# EAGLE design cnc-opto-board (EAGLE 7.6.0)
Level/Logic Translator Board Does field I/O to TTL level and logic translation for the CNC power panel project.
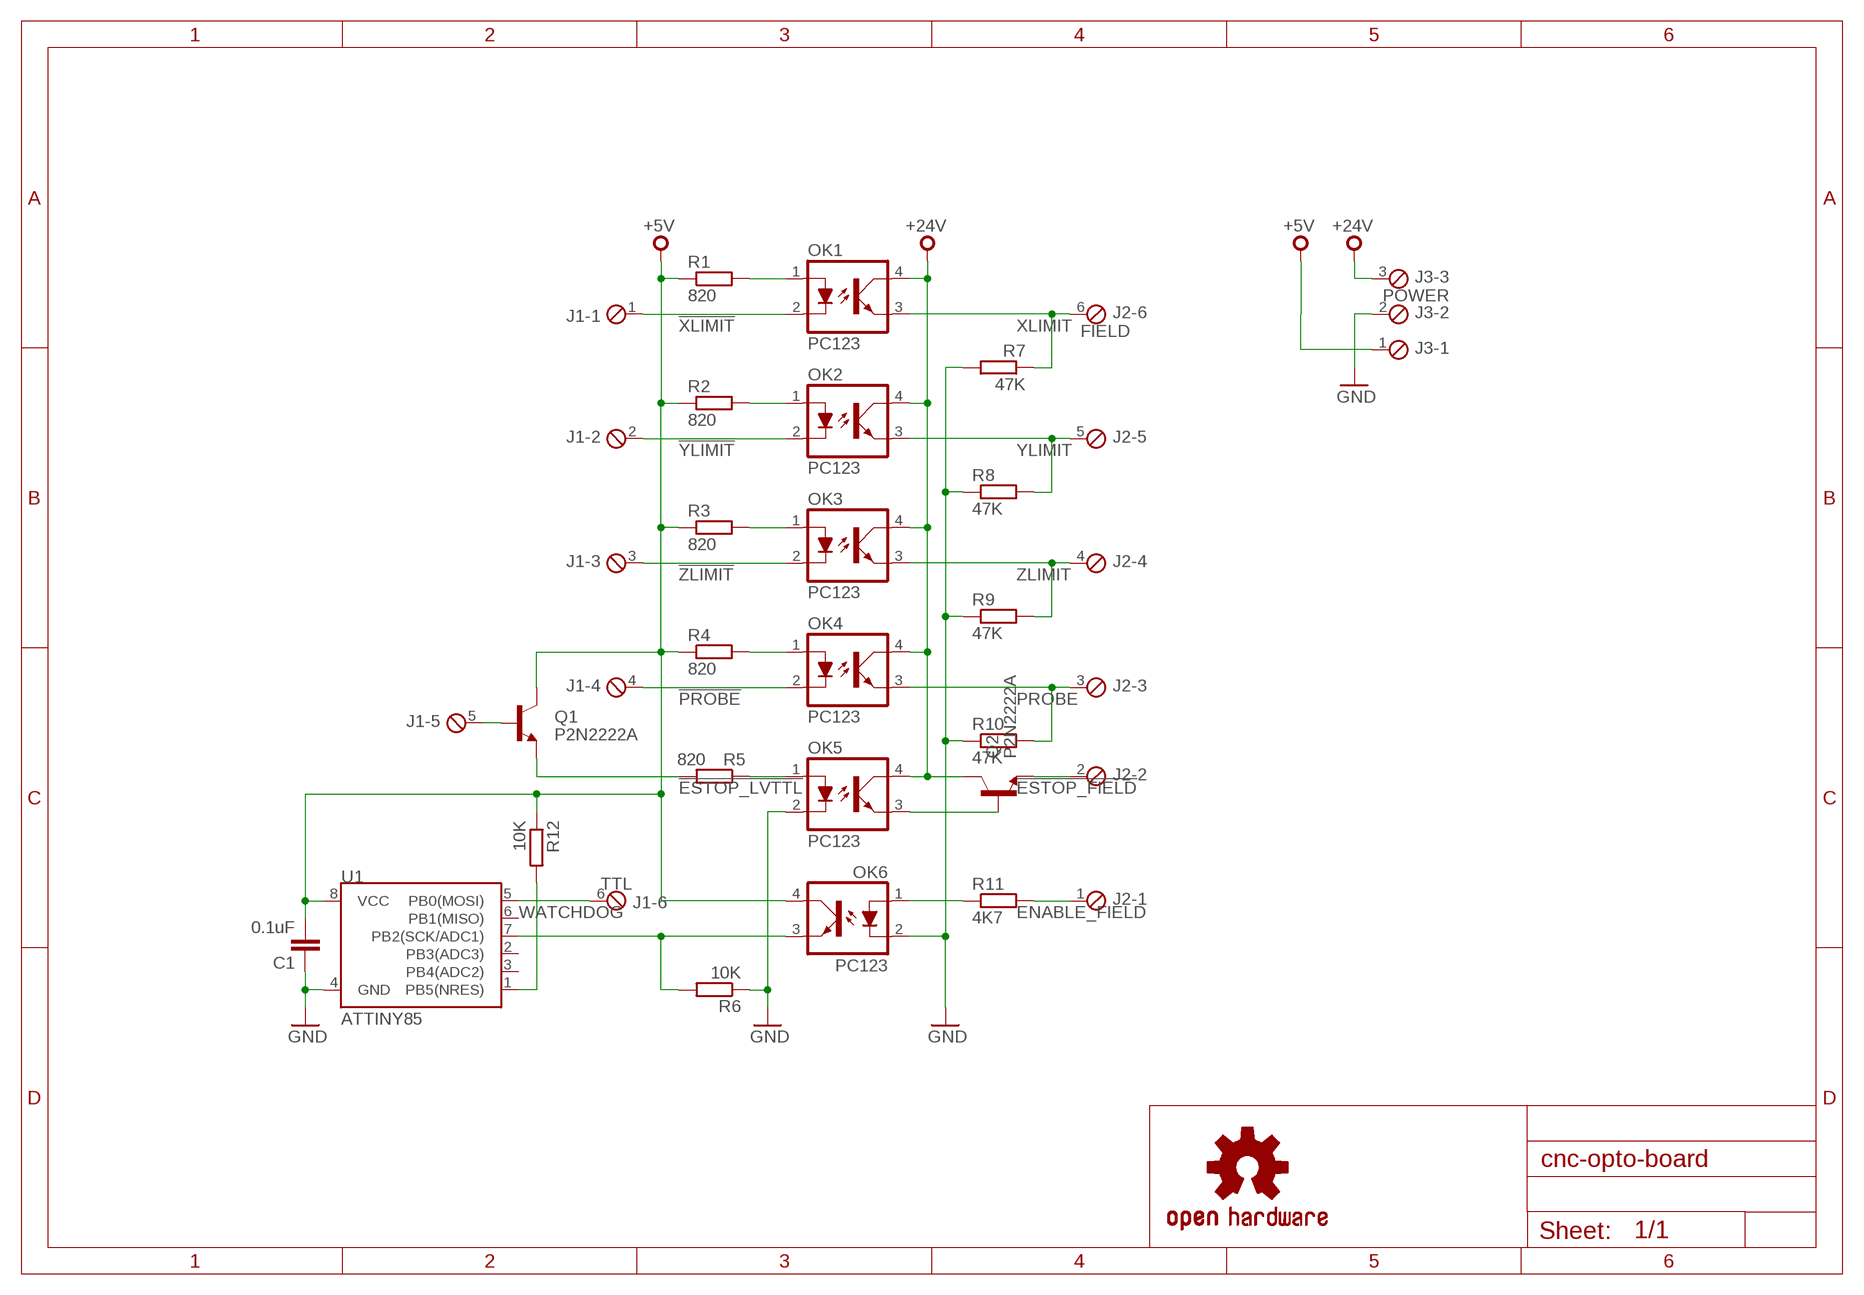
[diagram p0: schematic, sheet 1]

## Parts
C1  0.1uF  C-EU050-025X075  [C050-025X075]
J1  TTL  MKDS06  [MKDS06]
J2  FIELD  MKDS06  [MKDS06]
J3  POWER  MKDS03  [MKDS03]
LOGO1  OSHW-LOGOL  [OSHW-LOGO-L]
OK1  PC123  PC817  [DIL04]
OK2  PC123  PC817  [DIL04]
OK3  PC123  PC817  [DIL04]
OK4  PC123  PC817  [DIL04]
OK5  PC123  PC817  [DIL04]
OK6  PC123  PC817  [DIL04]
Q1  P2N2222A  TRANSISTOR_NPN_2PTH  [TO-92]
Q2  P2N2222A  TRANSISTOR_NPN_2PTH  [TO-92]
R1  820  R-EU_0207/10  [0207/10]
R2  820  R-EU_0207/10  [0207/10]
R3  820  R-EU_0207/10  [0207/10]
R4  820  R-EU_0207/10  [0207/10]
R5  820  R-EU_0207/10  [0207/10]
R6  10K  R-EU_0207/10  [0207/10]
R7  47K  R-EU_0207/10  [0207/10]
R8  47K  R-EU_0207/10  [0207/10]
R9  47K  R-EU_0207/10  [0207/10]
R10  47K  R-EU_0207/10  [0207/10]
R11  4K7  R-EU_0207/10  [0207/10]
R12  10K  R-EU_0207/10  [0207/10]
U1  ATTINY85  ATTINY45DIP8L  [DIL08]

## Nets
!ESTOP_FIELD: J2.2 Q2.3(E)
!ESTOP_LVTTL: OK5.1(A) R5.1
!PROBE: J1.4 OK4.2(C)
!XLIMIT: J1.1 OK1.2(C)
!YLIMIT: J1.2 OK2.2(C)
!ZLIMIT: J1.3 OK3.2(C)
+5V: C1.2 J3.1 OK6.4(COL) Q1.1(C) R1.1 R2.1 R3.1 R4.1 R12.1 U1.8(VCC)
+24V: J3.3 OK1.4(COL) OK2.4(COL) OK3.4(COL) OK4.4(COL) OK5.4(COL) Q2.1(C)
ENABLE_FIELD: J2.1 R11.2
ENABLE_TTL: OK6.3(EMIT) R6.2 U1.7(PB2(SCK/ADC1))
GND: C1.1 J3.2 OK5.2(C) OK6.2(C) R6.1 R7.2 R8.1 R9.1 R10.1 U1.4(GND)
N$1: OK1.1(A) R1.2
N$2: OK2.1(A) R2.2
N$3: OK3.1(A) R3.2
N$4: OK4.1(A) R4.2
N$5: Q1.3(E) R5.2
N$6: OK6.1(A) R11.1
N$7: J1.5 Q1.2(B)
N$8: OK5.3(EMIT) Q2.2(B)
N$9: R12.2 U1.1(PB5(NRES))
PROBE: J2.3 OK4.3(EMIT) R10.2
WATCHDOG: J1.6 U1.5(PB0(MOSI))
XLIMIT: J2.6 OK1.3(EMIT) R7.1
YLIMIT: J2.5 OK2.3(EMIT) R8.2
ZLIMIT: J2.4 OK3.3(EMIT) R9.2
Unconnected: U1.2(PB3(ADC3)) U1.3(PB4(ADC2)) U1.6(PB1(MISO))

## Library data of the parts
C1 = rcl:C-EU: CAPACITOR, European symbol
J1 J2 = con-phoenix-508:MKDS06: Screw Connector
J3 = con-phoenix-508:MKDS03: Screw Connector
LOGO1 = SparkFun-Aesthetics:OSHW-LOGO: Open Source Hardware Logo This logo indicates the piece of hardware it is found on incorporates a OSHW license and/or adheres to the definition of open source hardware found here: http://freedomdefined.org/OSHW
OK1-OK6 = optocoupler:PC817: SHARP OPTO COUPLER
Q1 Q2 = SparkFun-DiscreteSemi:TRANSISTOR_NPN_2: Alternate TO-92 NPN BJT
R1-R12 = rcl:R-EU_: RESISTOR, European symbol
U1 = SparkFun-DigitalIC-mine:ATTINY45: Atmel 8-pin 2/4/8kB flash uC

## Board
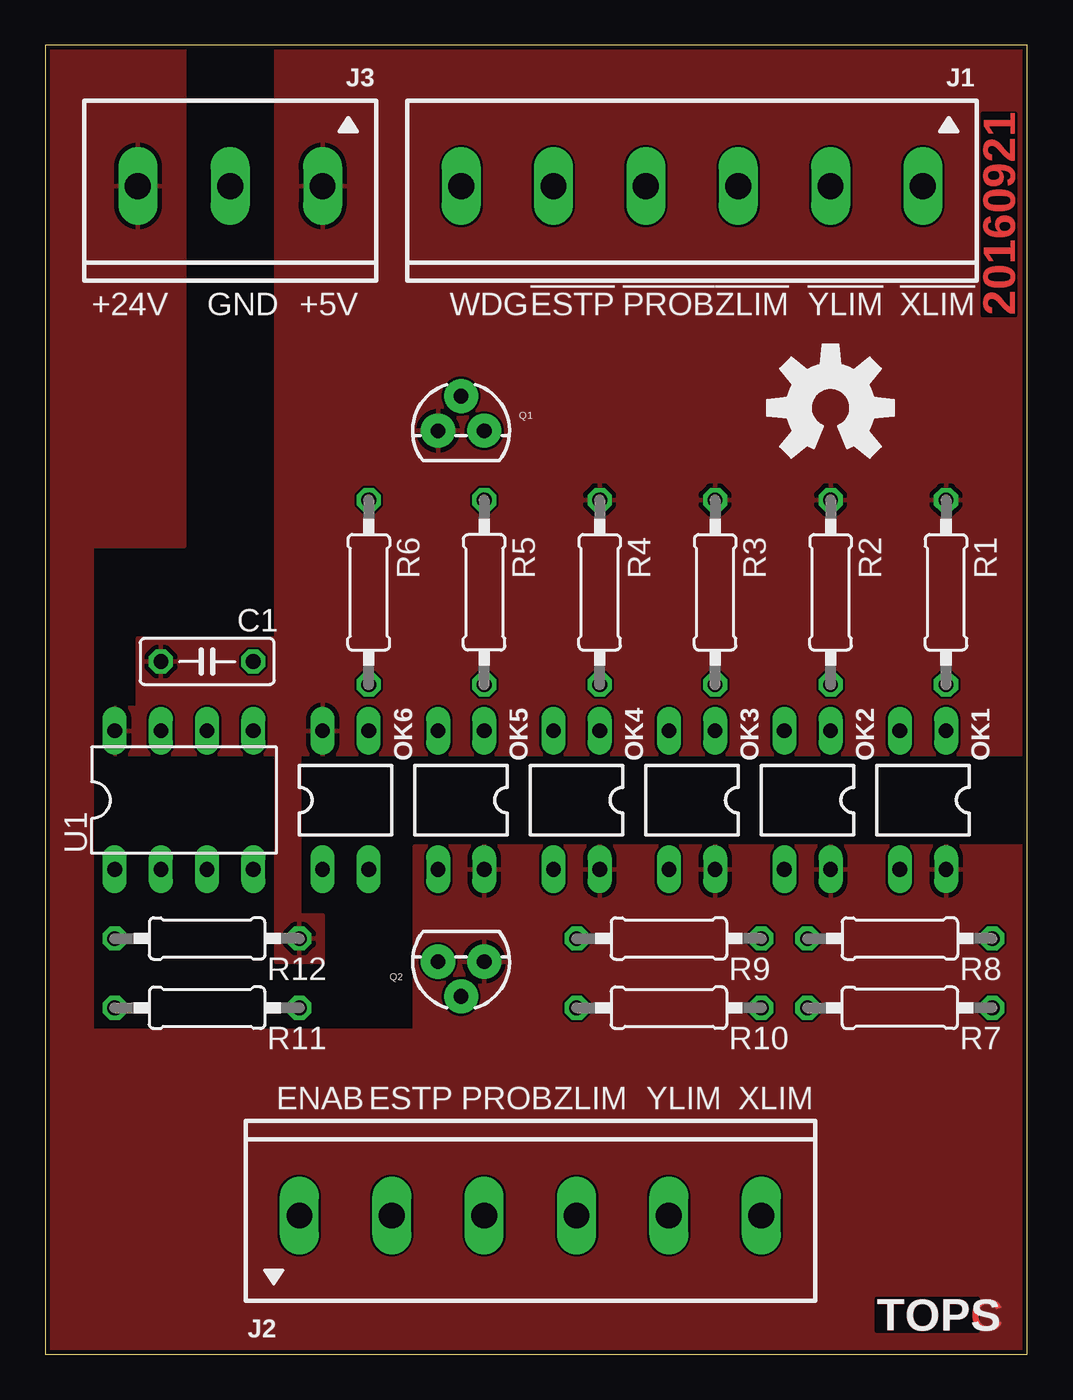
[diagram p1: board, top side]
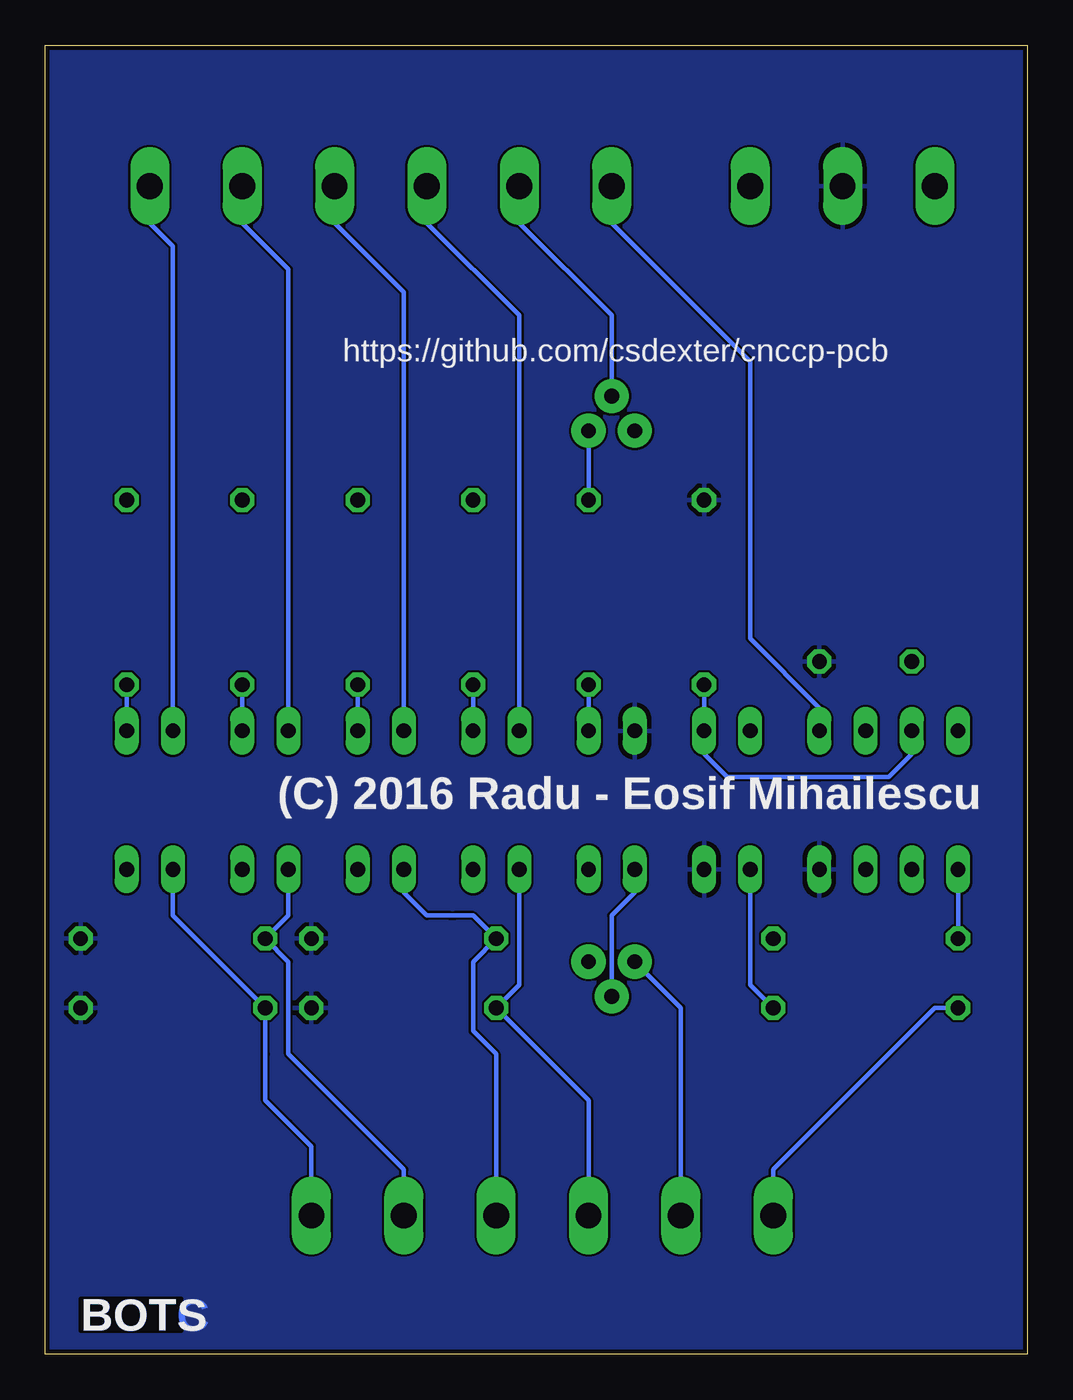
[diagram p2: board, bottom side, seen from below]

Size 54 x 72 mm. Coordinates in mm from the lower left corner, seen from the top.
Outline: 0,0 54,0 54,72 0,72 0,0
Copper layers (1*16): Top 0.035mm / dielectric 1.5mm / Bottom 0.035mm
Design rules "dirt_cheap_dirty_boards.v1": minimum track width 5mil, minimum drill 12mil, track to track 5mil, track to pad 5mil, pad to pad 5mil, via to via 5mil, smd to smd 0mil, copper to edge 10mil, drill to drill 10mil, minimum pad ring 10mil, minimum via ring 6mil, stop-mask expansion 2mil, vias tented up to drill 25mil, thermal gap 10mil

### Footprints (pad centres in the part's own frame; a part is rotated, then mirrored left to right if it is on the bottom)
C050-025X075 = drill 0.813 octagon: 1 -2.54,0; 2 2.54,0
MKDS06 = drill 1.422 long: 1 -12.7,0; 2 -7.62,0; 3 -2.54,0; 4 2.54,0; 5 7.62,0; 6 12.7,0
MKDS03 = drill 1.422 long: 1 -5.08,0; 2 0,0; 3 5.08,0
DIL04 = drill 0.813 long: 1 -1.27,-3.81; 2 1.27,-3.81; 3 1.27,3.81; 4 -1.27,3.81
TO-92 = drill 0.813 pad 1.88: 1 -1.27,0; 2 0,1.905; 3 1.27,0
0207/10 = drill 0.813 octagon: 1 -5.08,0; 2 5.08,0
DIL08 = drill 0.813 long: 1 -3.81,-3.81; 2 -1.27,-3.81; 3 1.27,-3.81; 4 3.81,-3.81; 5 3.81,3.81; 6 1.27,3.81; 7 -1.27,3.81; 8 -3.81,3.81

### Placement (x,y rotation side)
C1  8.89,38.1 180 top
J1  35.56,64.26 180 top
J2  26.67,7.62 0 top
J3  10.16,64.26 180 top
LOGO1  43.18,52.07 0 top
OK1  48.26,30.48 180 top
OK2  41.91,30.48 180 top
OK3  35.56,30.48 180 top
OK4  29.21,30.48 180 top
OK5  22.86,30.48 180 top
OK6  16.51,30.48 0 top
Q1  22.86,50.8 0 top
Q2  22.86,21.59 180 top
R1  49.53,41.91 270 top
R2  43.18,41.91 270 top
R3  36.83,41.91 270 top
R4  30.48,41.91 270 top
R5  24.13,41.91 90 top
R6  17.78,41.91 270 top
R7  46.99,19.05 0 top
R8  46.99,22.86 180 top
R9  34.29,22.86 180 top
R10  34.29,19.05 180 top
R11  8.89,19.05 180 top
R12  8.89,22.86 180 top
U1  7.62,30.48 0 top

### Tracks (layer width: path | path; a pad name or v marks a point on that pad's centre or on a via)
!ESTOP_FIELD
  Bottom 0.254: Q2.3 19.05,19.05 J2.2
!ESTOP_LVTTL
  Bottom 0.254: OK5.1 R5.1
!PROBE
  Bottom 0.254: OK4.2 27.94,57.15 33.02,62.23 J1.4
!XLIMIT
  Bottom 0.254: OK1.2 46.99,60.96 48.26,62.23 J1.1
!YLIMIT
  Bottom 0.254: OK2.2 40.64,48.26 40.64,57.15 40.64,59.69 43.18,62.23 J1.2
!ZLIMIT
  Bottom 0.254: OK3.2 34.29,46.99 34.29,58.42 38.1,62.23 J1.3
+5V
  pour Top: 12.7,72 54,72 54,33.02 13.97,33.02 13.97,24.13 15.24,24.13 15.24,21.59 12.7,21.59 12.7,33.02 3.81,33.02 3.81,35.56 5.08,35.56 5.08,39.37 12.7,39.37
+24V
  pour Top: 0,0 54,0 54,27.94 20.32,27.94 20.32,17.78 2.54,17.78 2.54,44.45 7.62,44.45 7.62,72 0,72
ENABLE_FIELD
  Bottom 0.254: J2.1 13.97,10.16 5.08,19.05 R11.2
ENABLE_TTL
  Bottom 0.254: R6.2 OK6.3 17.78,33.02 16.51,31.75 11.43,31.75 7.62,31.75 6.35,33.02 U1.7
GND
  pour Bottom: 0,0 54,0 54,72 0,72
N$1
  Bottom 0.254: OK1.1 R1.2
N$2
  Bottom 0.254: OK2.1 R2.2
N$3
  Bottom 0.254: OK3.1 R3.2
N$4
  Bottom 0.254: OK4.1 R4.2
N$5
  Bottom 0.254: Q1.3 R5.2
N$6
  Bottom 0.254: OK6.1 15.24,20.32 R11.1
N$7
  Bottom 0.254: Q1.2 22.86,57.15 27.94,62.23 J1.5
N$8
  Bottom 0.254: OK5.3 21.59,25.4 22.86,24.13 Q2.2
N$9
  Bottom 0.254: U1.1 R12.2
PROBE
  Bottom 0.254: OK4.3 27.94,20.32 R10.2 24.13,13.97 J2.3
WATCHDOG
  Bottom 0.254: U1.5 11.43,35.56 15.24,39.37 15.24,54.61 22.86,62.23 J1.6
XLIMIT
  Bottom 0.254: OK1.3 46.99,24.13 R7.1 41.91,16.51 41.91,13.97 40.64,12.7 39.37,11.43 J2.6
YLIMIT
  Bottom 0.254: OK2.3 40.64,24.13 R8.2 40.64,21.59 40.64,16.51 34.29,10.16 J2.5
ZLIMIT
  Bottom 0.254: OK3.3 34.29,25.4 33.02,24.13 31.75,24.13 31.5,24.13 30.48,24.13 R9.2 30.48,21.59 30.48,17.78 29.21,16.51 J2.4

### Text on the board
Top: 20160921 | TOPC
Bottom: BOTC
tPlace: +24V | GND | +5V | WDG | !ESTP | !PROB | !ZLIM | !YLIM | !XLIM | ENAB | ESTP | PROB | ZLIM | YLIM | XLIM | TOPS
bPlace: https://github.com/csdexter/cnccp-pcb | (C) 2016 Radu - Eosif Mihailescu | BOTS